# Altium project Base18 SD Card.PrjPCB
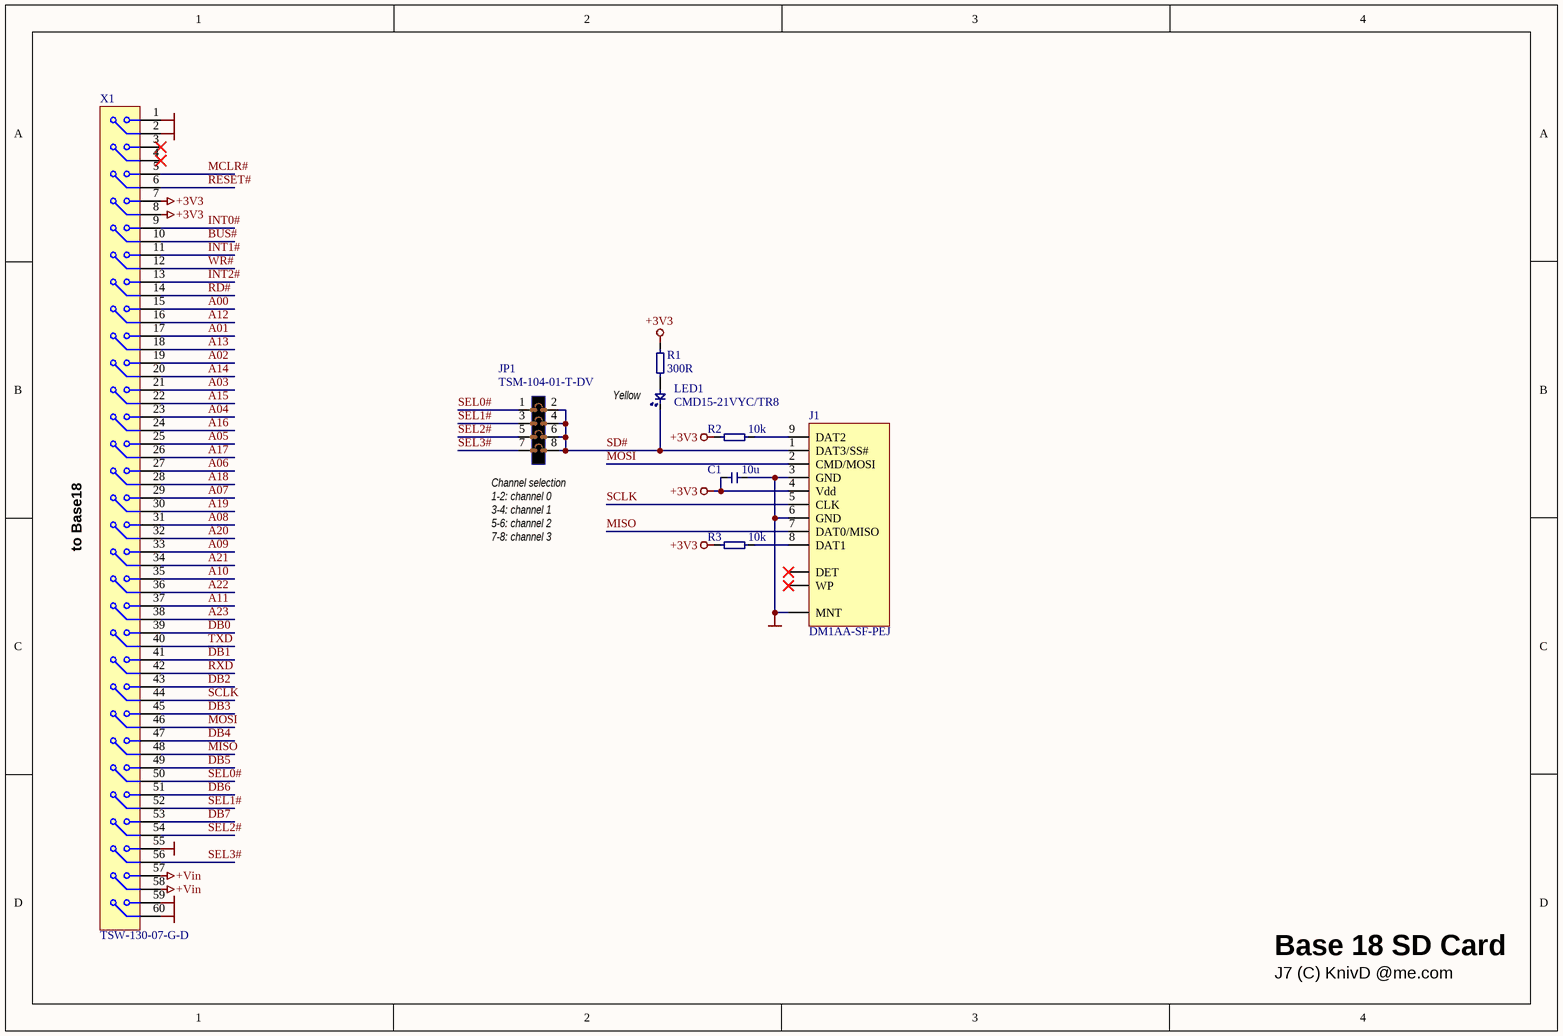
[diagram p0: Sheet1.SchDoc]
1 sheet, 8 parts. Net scope: global (net labels, ports and power ports of the same name join across sheets).
Board file: PCB1.PcbDoc

## Sheet Sheet1.SchDoc
size A4

### Parts
C1  10u  [CAPC3216X110N]
J1  DM1AA-SF-PEJ  [DM1AA-SF-PEJ]
JP1  TSM-104-01-T-DV  [2015-2X04XD]
LED1  CMD15-21VYC/TR8  [LED_OSRAM_LYN971]
R1  300R  [RESC3216X75N]
R2  10k  [RESC3216X75N]
R3  10k  [RESC3216X75N]
X1  TSW-130-07-G-D  [DIL60-M-EDGE]

### Nets
+3V3: C1.1 J1.4(Vdd) R1.2 R2.2 R3.2 X1.7 X1.8
+Vin: X1.57 X1.58
GND: C1.2 J1.0(MNT) J1.3(GND) J1.6(GND) X1.1 X1.2 X1.55 X1.59 X1.60
A00: X1.15
A01: X1.17
A02: X1.19
A03: X1.21
A04: X1.23
A05: X1.25
A06: X1.27
A07: X1.29
A08: X1.31
A09: X1.33
A10: X1.35
A11: X1.37
A12: X1.16
A13: X1.18
A14: X1.20
A15: X1.22
A16: X1.24
A17: X1.26
A18: X1.28
A19: X1.30
A20: X1.32
A21: X1.34
A22: X1.36
A23: X1.38
BUS#: X1.10
DB0: X1.39
DB1: X1.41
DB2: X1.43
DB3: X1.45
DB4: X1.47
DB5: X1.49
DB6: X1.51
DB7: X1.53
INT0#: X1.9
INT1#: X1.11
INT2#: X1.13
MCLR#: X1.5
MISO: J1.7(DAT0/MISO) X1.48
MOSI: J1.2(CMD/MOSI) X1.46
RD#: X1.14
RESET#: X1.6
RXD: X1.42
SCLK: J1.5(CLK) X1.44
SD#: J1.1(DAT3/SS#) JP1.2 JP1.4 JP1.6 JP1.8 LED1.1
SEL0#: JP1.1 X1.50
SEL1#: JP1.3 X1.52
SEL2#: JP1.5 X1.54
SEL3#: JP1.7 X1.56
TXD: X1.40
WR#: X1.12
NetJ1_8: J1.8(DAT1) R3.1
NetJ1_9: J1.9(DAT2) R2.1
NetLED1_2: LED1.2 R1.1

Not connected (* = marked no-connect by the designer): J1 DET* WP*; X1 3* 4*

### Notes on the sheet
- Yellow
- (near JP1) Channel selection
- (near JP1) 1-2: channel 0
- 3-4: channel 1
- to Base18
- 5-6: channel 2
- 7-8: channel 3
- Base 18 SD Card
- J7 (C) KnivD @me.com

### Library data of the parts
C1 = Capacitor
J1 = SD (w/ card detect and WP): SD card connector
JP1 = Jumper 4x2: 2.54mm square pin header/jumper
LED1 = LED: Light Emitting Diode
R1-R3 = Resistor
X1 = Connector 2x30: Dual row, 60-way connector